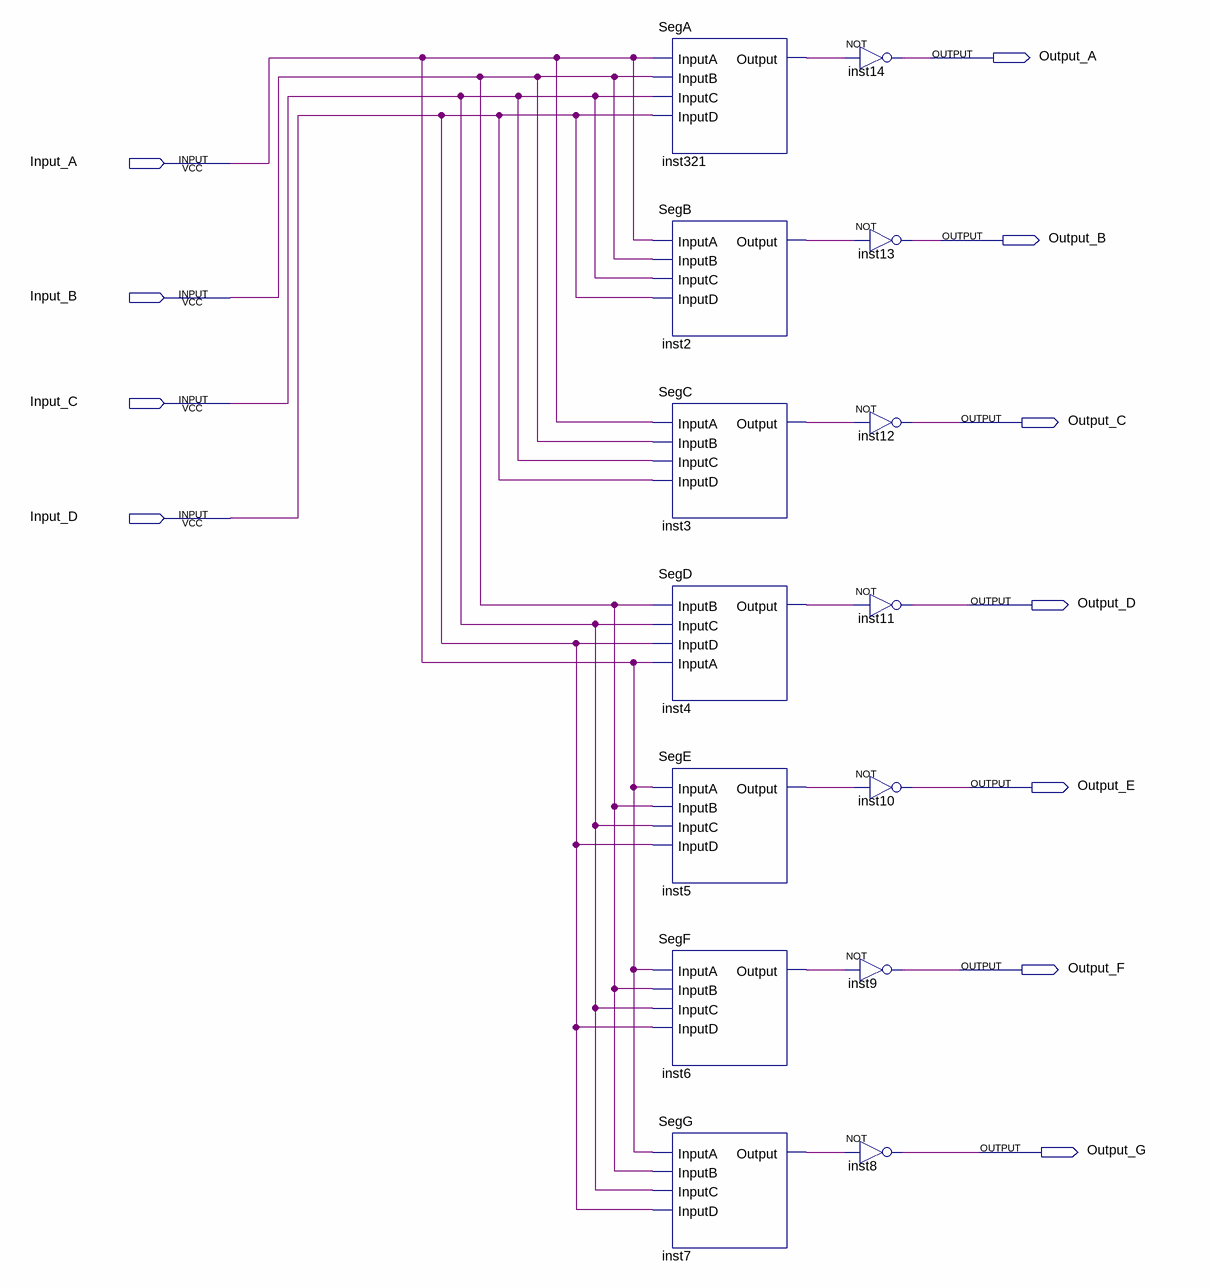
[diagram p0: schematic sheet]
// Quartus schematic agoravai.bdf as structural Verilog: 14 symbols, 11 pins
module agoravai (
  input  Input_A,
  input  Input_B,
  input  Input_C,
  input  Input_D,
  output Output_A,
  output Output_B,
  output Output_C,
  output Output_D,
  output Output_E,
  output Output_F,
  output Output_G
);

  wire inst2_output, inst3_output, inst4_output, inst5_output, inst6_output, inst7_output, inst321_output;

  SegA inst321 (.InputA(Input_A), .InputB(Input_B), .InputC(Input_C), .InputD(Input_D), .Output(inst321_output));
  SegB inst2 (.InputA(Input_A), .InputB(Input_B), .InputC(Input_C), .InputD(Input_D), .Output(inst2_output));
  SegC inst3 (.InputA(Input_A), .InputB(Input_B), .InputC(Input_C), .InputD(Input_D), .Output(inst3_output));
  SegD inst4 (.InputB(Input_B), .InputC(Input_C), .InputD(Input_D), .InputA(Input_A), .Output(inst4_output));
  SegE inst5 (.InputA(Input_A), .InputB(Input_B), .InputC(Input_C), .InputD(Input_D), .Output(inst5_output));
  SegF inst6 (.InputA(Input_A), .InputB(Input_B), .InputC(Input_C), .InputD(Input_D), .Output(inst6_output));
  SegG inst7 (.InputA(Input_A), .InputB(Input_B), .InputC(Input_C), .InputD(Input_D), .Output(inst7_output));
  not inst14 (Output_A, inst321_output);
  not inst9 (Output_F, inst6_output);
  not inst8 (Output_G, inst7_output);
  not inst13 (Output_B, inst2_output);
  not inst12 (Output_C, inst3_output);
  not inst11 (Output_D, inst4_output);
  not inst10 (Output_E, inst5_output);
endmodule
